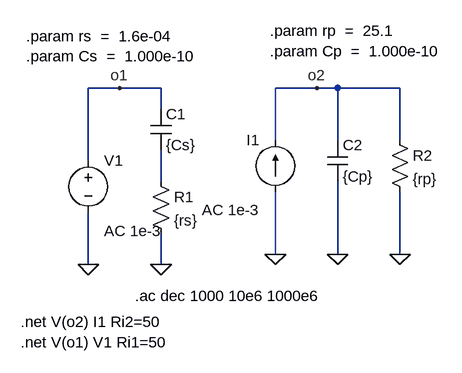
[diagram p0: schematic eje2.asc]
eje2.asc, the LTspice schematic file:
Version 4
SHEET 1 880 680
WIRE -64 -48 -112 -48
WIRE 0 -48 -64 -48
WIRE 240 -48 176 -48
WIRE 272 -48 240 -48
WIRE 368 -48 272 -48
WIRE 0 -16 0 -48
WIRE 176 32 176 -48
WIRE 272 32 272 -48
WIRE 368 32 368 -48
WIRE -112 64 -112 -48
WIRE 0 96 0 48
WIRE 176 208 176 112
WIRE 272 208 272 96
WIRE 368 208 368 112
WIRE -112 224 -112 144
WIRE 0 224 0 176
FLAG 0 224 0
FLAG 272 208 0
FLAG 368 208 0
FLAG 176 208 0
FLAG -112 224 0
FLAG 240 -48 o2
FLAG -64 -48 o1
SYMBOL res -16 80 R0
SYMATTR InstName R1
SYMATTR Value {rs}
SYMBOL res 352 16 R0
SYMATTR InstName R2
SYMATTR Value {rp}
SYMBOL voltage -112 48 R0
WINDOW 123 24 124 Left 2
WINDOW 39 0 0 Left 0
SYMATTR InstName V1
SYMATTR Value ""
SYMATTR Value2 AC 1e-3
SYMBOL current 176 112 R180
WINDOW 0 24 80 Left 2
WINDOW 3 24 0 Left 2
WINDOW 123 24 -28 Left 2
WINDOW 39 0 0 Left 0
SYMATTR InstName I1
SYMATTR Value ""
SYMATTR Value2 AC 1e-3
SYMBOL cap -16 -16 R0
SYMATTR InstName C1
SYMATTR Value {Cs}
SYMBOL cap 256 32 R0
SYMATTR InstName C2
SYMATTR Value {Cp}
TEXT -40 272 Left 2 !.ac dec 1000 10e6 1000e6
TEXT -216 312 Left 2 !.net V(o2) I1 Ri2=50
TEXT -216 344 Left 2 !.net V(o1) V1 Ri1=50
TEXT -208 -128 Left 2 !.param rs  =  1.6e-04 \n.param Cs  =  1.000e-10
TEXT 168 -136 Left 2 !.param rp  =  25.1 \n.param Cp  =  1.000e-10

The netlist it stands for:
* eje2.asc
R1 N001 0 {rs}
R2 o2 0 {rp}
V1 o1 0 AC 1e-3
I1 0 o2 AC 1e-3
C1 o1 N001 {Cs}
C2 o2 0 {Cp}
.ac dec 1000 10e6 1000e6
.net V(o2) I1 Ri2=50
.net V(o1) V1 Ri1=50
.param rs  =  1.6e-04
.param Cs  =  1.000e-10
.param rp  =  25.1
.param Cp  =  1.000e-10
.backanno
.end